# Altium schematic sheet wristband_ee459.SchDoc
size A
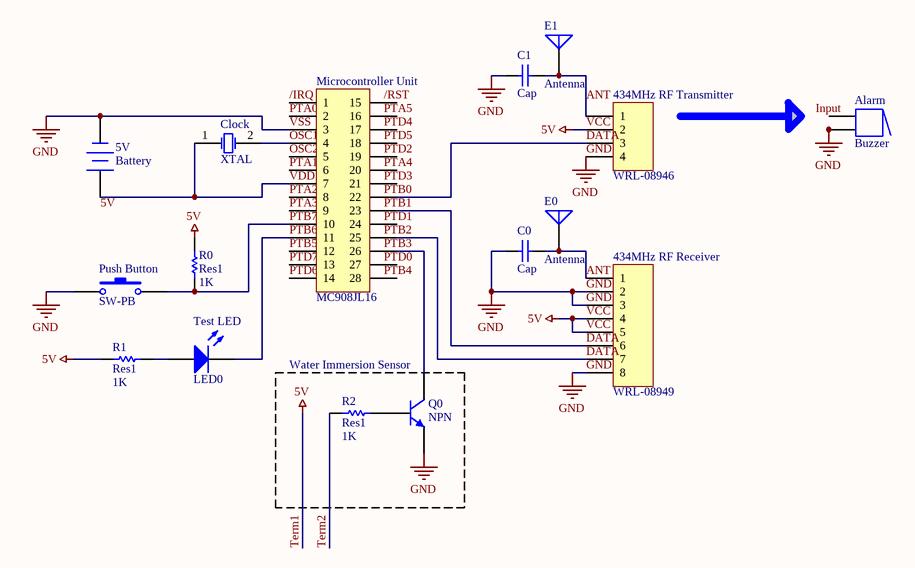
[diagram p0: wristband_ee459.SchDoc]

## Parts
5V  Battery  [BAT-2]
434MHz_RF_Receiver  WRL-08949  [HDR1X8]
434MHz_RF_Transmitter  WRL-08946  [HDR1X4]
Alarm  Buzzer  [ABSM-1574]
C0  Cap  [RAD-0.3]
C1  Cap  [RAD-0.3]
Clock  XTAL  [R38]
E0  Antenna  [PIN1]
E1  Antenna  [PIN1]
Microcontroller_Unit  MC908JL16  [HDR2X14_CEN]
Push_Button  SW-PB  [SPST-2]
Q0  NPN  [TO-226]
R0  Res1  value 1K  [AXIAL-0.3]
R1  Res1  value 1K  [AXIAL-0.3]
R2  Res1  value 1K  [AXIAL-0.3]
Test_LED  LED0  [LED-0]

## Blocks framed on the sheet
Water Immersion Sensor: Q0 R2

## Nets
GND: 5V.2(-) 434MHz_RF_Receiver.2 434MHz_RF_Receiver.3 434MHz_RF_Receiver.8 434MHz_RF_Transmitter.4 Alarm.2 Alarm.2A C0.1 C1.1 Microcontroller_Unit.3 Push_Button.1 Q0.3(E)  [also labelled VSS]
Term1: 434MHz_RF_Receiver.4 434MHz_RF_Receiver.5 434MHz_RF_Transmitter.2 R0.2 R1.2  [also labelled 5V, VCC]
/IRQ: Microcontroller_Unit.1
ANT: 434MHz_RF_Receiver.1 434MHz_RF_Transmitter.1 C0.2 C1.2 E0.1(A) E1.1(A)
DATA: 434MHz_RF_Receiver.6 434MHz_RF_Receiver.7 434MHz_RF_Transmitter.3 Microcontroller_Unit.22 Microcontroller_Unit.23 Microcontroller_Unit.25
OSC1: Clock.2(OSC2) Microcontroller_Unit.4
OSC2: Microcontroller_Unit.5
PTA0: Microcontroller_Unit.2
PTA1: Microcontroller_Unit.6
PTA2: Microcontroller_Unit.8
PTA3: Microcontroller_Unit.9
PTB5: Microcontroller_Unit.12
PTB6: Microcontroller_Unit.11 Test_LED.2(K)
PTB7: Microcontroller_Unit.10 Push_Button.2 R0.1
PTD6: Microcontroller_Unit.14
PTD7: Microcontroller_Unit.13
Term2: R2.1
VDD: 5V.1(+) Clock.1(OSC1) Microcontroller_Unit.7
NetAlarm_1: Alarm.1 Alarm.1A
NetMicrocontroller_Unit_26: Microcontroller_Unit.26 Q0.1(C)
NetQ0_2: Q0.2(B) R2.2
NetR1_1: R1.1 Test_LED.1(A)

Not connected (* = marked no-connect by the designer): Microcontroller_Unit 15 16 17 18 19 20 21 24 27 28

## Notes on the sheet
- Labels drawn without touching a wire or pin: 5V, /RST, Input, PTA4, PTA5, PTB0, PTB1, PTB2, PTB3, PTB4, PTD0, PTD1, PTD2, PTD3, PTD4, PTD5

## Library data of the parts
5V = Battery: Multicell Battery; Published: 24-Mar-1999; LatestRevisionDate: 17-Jul-2002; LatestRevisionNote: Re-released for DXP Platform.; PackageReference: BAT-2; Publisher: Altium Limited
434MHz_RF_Receiver = Header 8: Header, 8-Pin; LatestRevisionDate: 17-Jul-2002; LatestRevisionNote: Re-released for DXP Platform.; Publisher: Altium Limited
434MHz_RF_Transmitter = Header 4: Header, 4-Pin; LatestRevisionDate: 17-Jul-2002; LatestRevisionNote: Re-released for DXP Platform.; Publisher: Altium Limited
Alarm = Buzzer: Magnetic Transducer Buzzer; Published: 24-Mar-1999; LatestRevisionDate: 17-Dec-2003; LatestRevisionNote: Schematic revised, PCB Footprint replaced.; DatasheetDocument: 17-Dec-2003; PackageReference: ABSM-1574; Publisher: Altium Limited; ComponentLink1Description: Manufacturer Link; ComponentLink1URL: http://www.megastar.com/linecard/buzzmode/index.php
C0 C1 = Cap: Capacitor; Value: 100pF; Published: 8-Jun-2000; LatestRevisionDate: 17-Jul-2002; LatestRevisionNote: Re-released for DXP Platform.; PackageReference: RAD-0.3; Publisher: Altium Limited
Clock = XTAL: Crystal Oscillator; Published: 8-Jun-2000; LatestRevisionDate: 17-Jul-2002; LatestRevisionNote: Re-released for DXP Platform.; PackageReference: R38; Publisher: Altium Limited
E0 E1 = Antenna: Generic Antenna; Published: 24-Mar-1999; LatestRevisionDate: 17-Jul-2002; LatestRevisionNote: Re-released for DXP Platform.; PackageReference: PIN1; Publisher: Altium Limited
Microcontroller_Unit = Header 14X2A: Header, 14-Pin, Dual row; LatestRevisionDate: 17-Jul-2002; LatestRevisionNote: Re-released for DXP Platform.; Publisher: Altium Limited
Push_Button = SW-PB: Switch; Published: 24-Mar-1999; LatestRevisionDate: 17-Jul-2002; LatestRevisionNote: Re-released for DXP Platform.; PackageReference: SPST-2; Publisher: Altium Limited
Q0 = NPN: NPN Bipolar Transistor; Published: 8-Jun-2000; LatestRevisionDate: 17-Jul-2002; LatestRevisionNote: Re-released for DXP Platform.; PackageReference: TO-226; Publisher: Altium Limited; Code_JEDEC: TO-226-AA
R0-R2 = Res1: Resistor; Published: 8-Jun-2000; LatestRevisionDate: 17-Jul-2002; LatestRevisionNote: Re-released for DXP Platform.; PackageReference: AXIAL-0.3; Publisher: Altium Limited
Test_LED = LED0: Typical INFRARED GaAs LED; Published: 8-Jun-2000; LatestRevisionDate: 08-Jul-2005; LatestRevisionNote: Mech Layer 1 removed.; PackageReference: LED-0; Publisher: Altium Limited